# EAGLE design M191X (EAGLE 6.6.0)
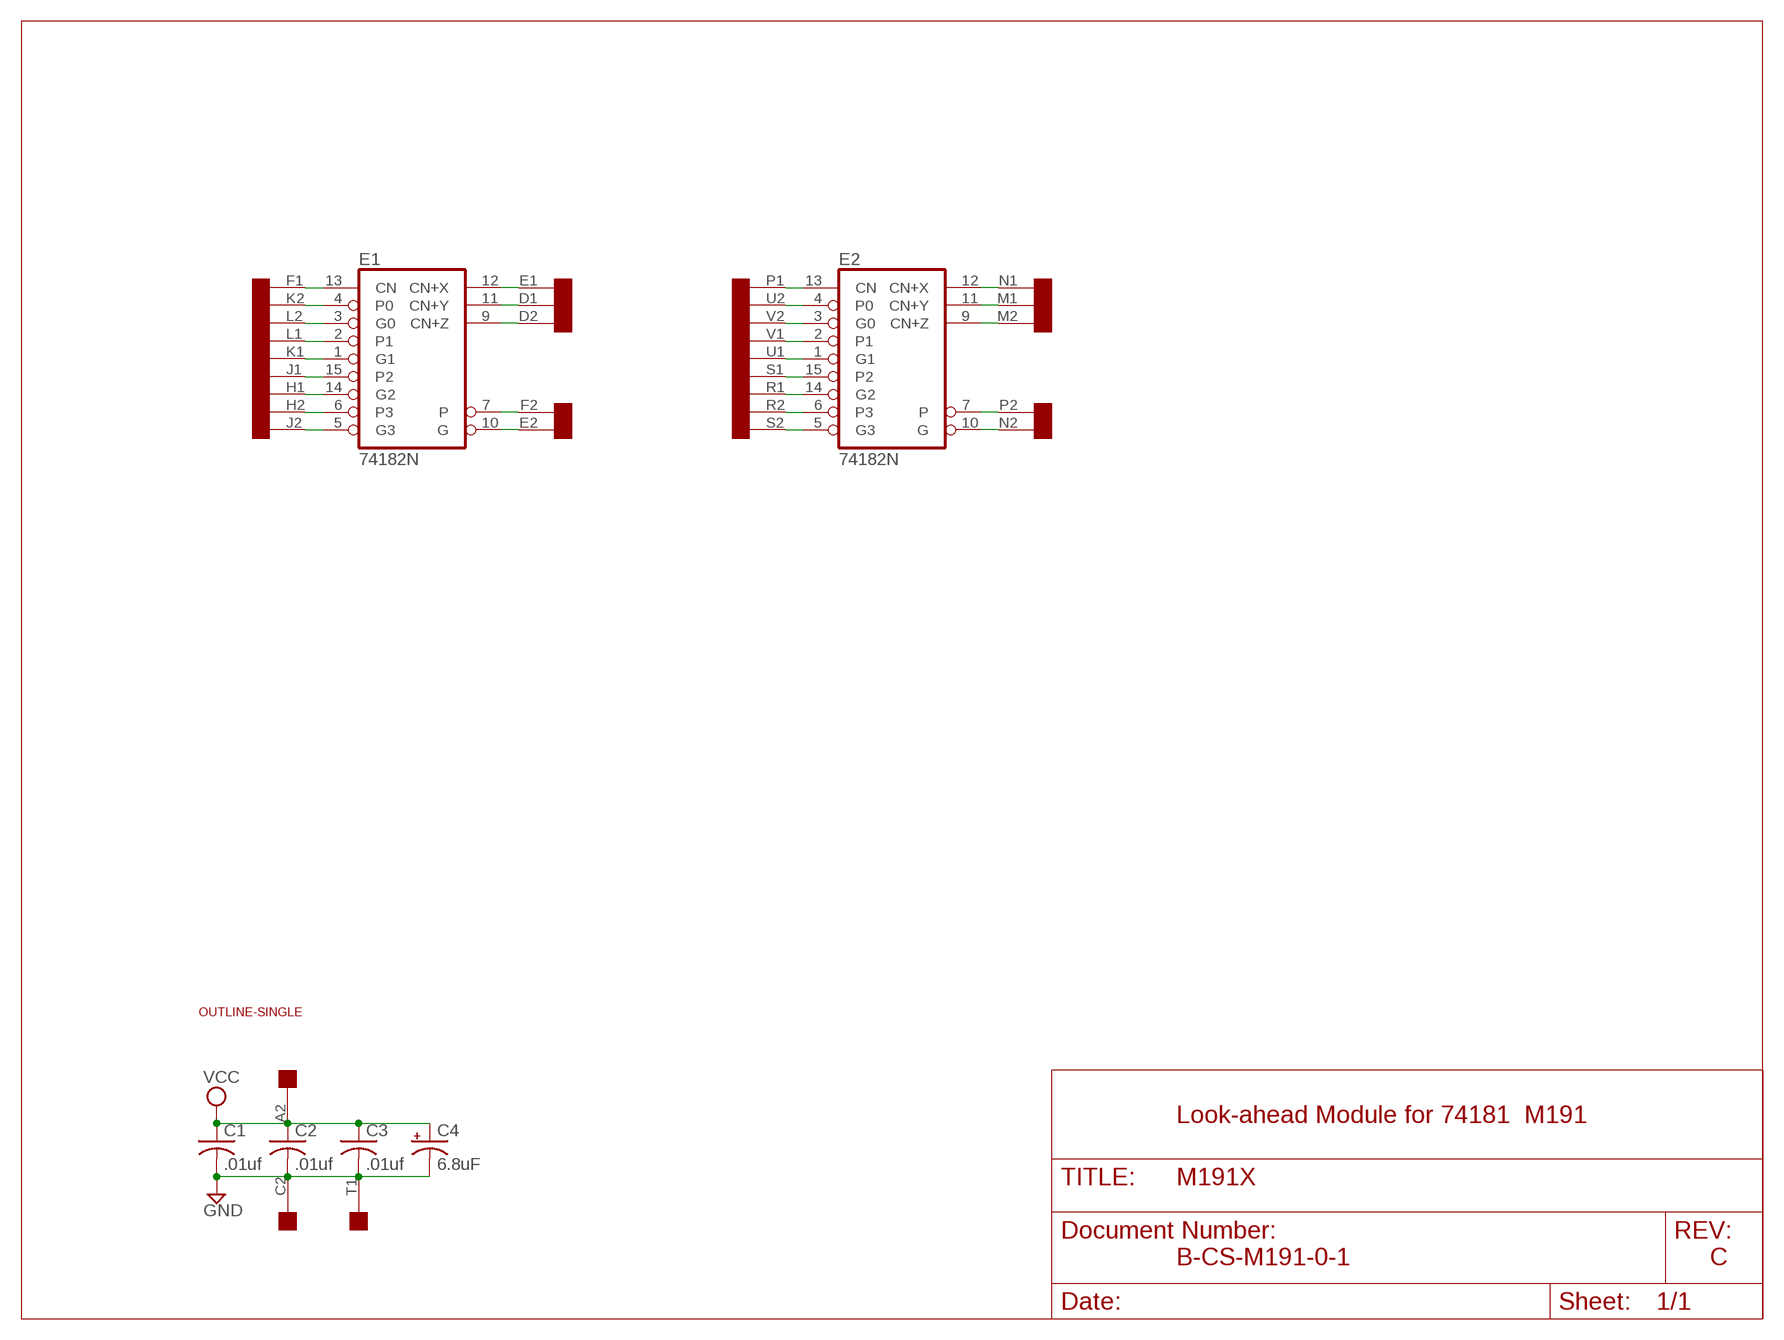
[diagram p0: schematic, sheet 1]

## Parts
C1  .01uf  C-US050-025X075  [C050-025X075]
C2  .01uf  C-US050-025X075  [C050-025X075]
C3  .01uf  C-US050-025X075  [C050-025X075]
C4  6.8uF  CPOL-USE22-6AXIAL  [E22-6]
E1  74182N  74S182N  [DIL16]
E2  74182N  74S182N  [DIL16]
U$1  OUTLINE-SINGLE  [SINGLE]
U$2  EDGE-2CONNECTOR  [EDGE-CON2]

## Nets
GND [Supply]: C1.2 C2.2 C3.2 C4.- U$2.C2 U$2.T1
N$1: E1.6(P3) U$2.H2
N$2: E1.2(P1) U$2.L1
N$3: E1.5(G3) U$2.J2
N$4: E1.15(P2) U$2.J1
N$5: E1.14(G2) U$2.H1
N$6: E1.1(G1) U$2.K1
N$7: E1.4(P0) U$2.K2
N$8: E1.3(G0) U$2.L2
N$9: E1.13(CN) U$2.F1
N$10: E1.7(P) U$2.F2
N$11: E1.10(G) U$2.E2
N$12: E1.9(CN+Z) U$2.D2
N$13: E1.11(CN+Y) U$2.D1
N$14: E1.12(CN+X) U$2.E1
N$15: E2.13(CN) U$2.P1
N$16: E2.3(G0) U$2.V2
N$17: E2.4(P0) U$2.U2
N$18: E2.1(G1) U$2.U1
N$19: E2.2(P1) U$2.V1
N$20: E2.15(P2) U$2.S1
N$21: E2.14(G2) U$2.R1
N$22: E2.6(P3) U$2.R2
N$23: E2.5(G3) U$2.S2
N$24: E2.7(P) U$2.P2
N$25: E2.10(G) U$2.N2
N$26: E2.9(CN+Z) U$2.M2
N$27: E2.11(CN+Y) U$2.M1
N$28: E2.12(CN+X) U$2.N1
VCC [Supply]: C1.1 C2.1 C3.1 C4.+ U$2.A2
Unconnected: U$2.A1 U$2.B1 U$2.B2 U$2.C1 U$2.T2

## Notes on the sheet
- Look-ahead Module for 74181  M191
- B-CS-M191-0-1 | C

## Power pins joined to a net without a drawn wire
GND: E1.8(GND) E2.8(GND)
VCC: E1.16(VCC) E2.16(VCC)

## Library data of the parts
C1-C3 = rcl:C-US: CAPACITOR, American symbol
C4 = rcl:CPOL-US: POLARIZED CAPACITOR, American symbol
E1 E2 = 74xx-us:74*182: LOOK AHEAD CARRY GENERATOR
U$1 = dec-con:OUTLINE-*: Board outlines for DEC boards.
U$2 = dec-con:EDGE-2: Double-Sided DEC edge connector.

## Net classes
1 Supply: width 0.813 mm

## Board
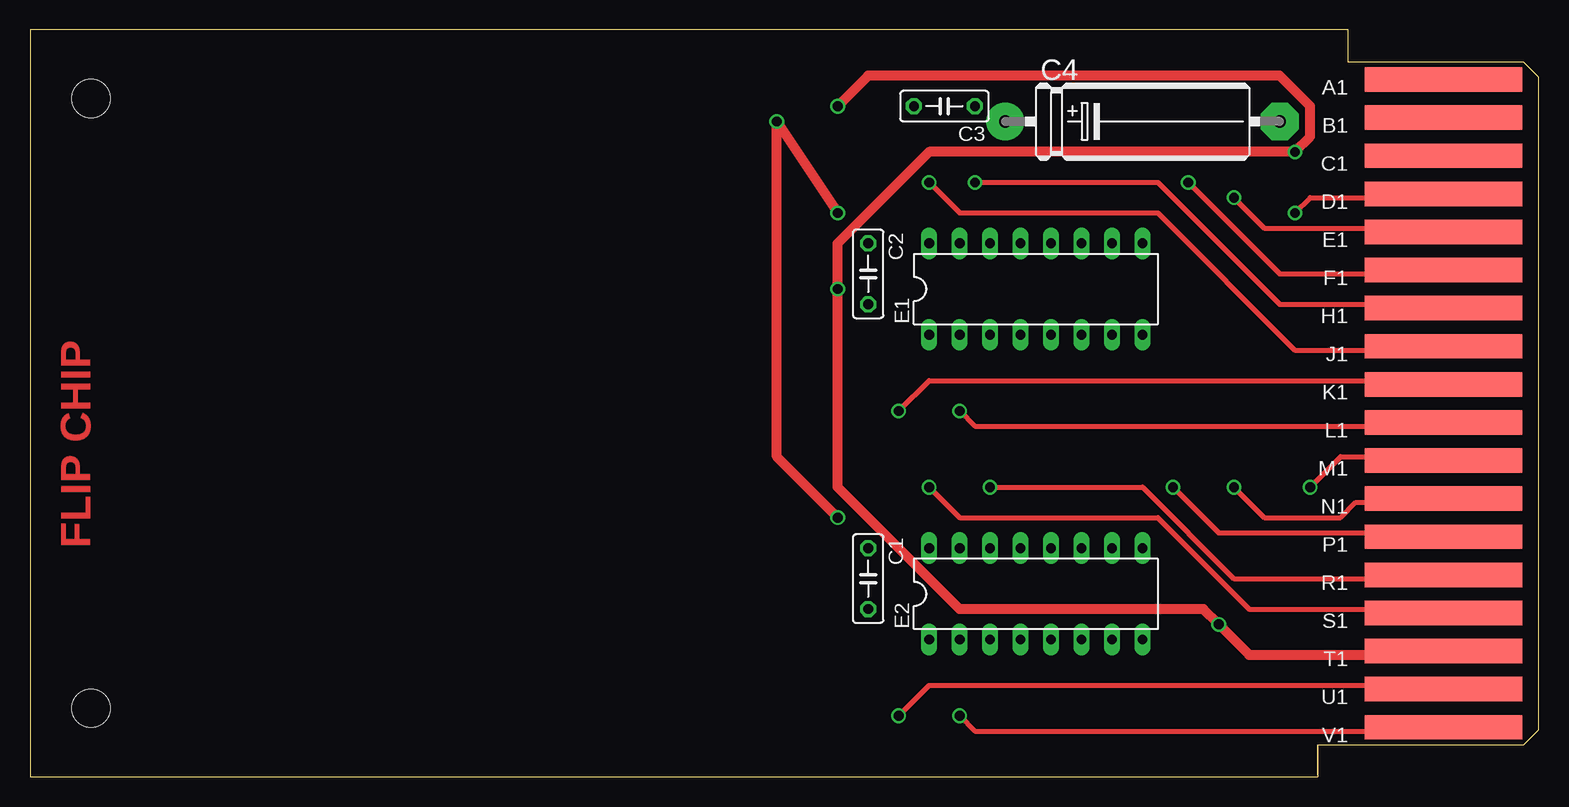
[diagram p1: board, top side]
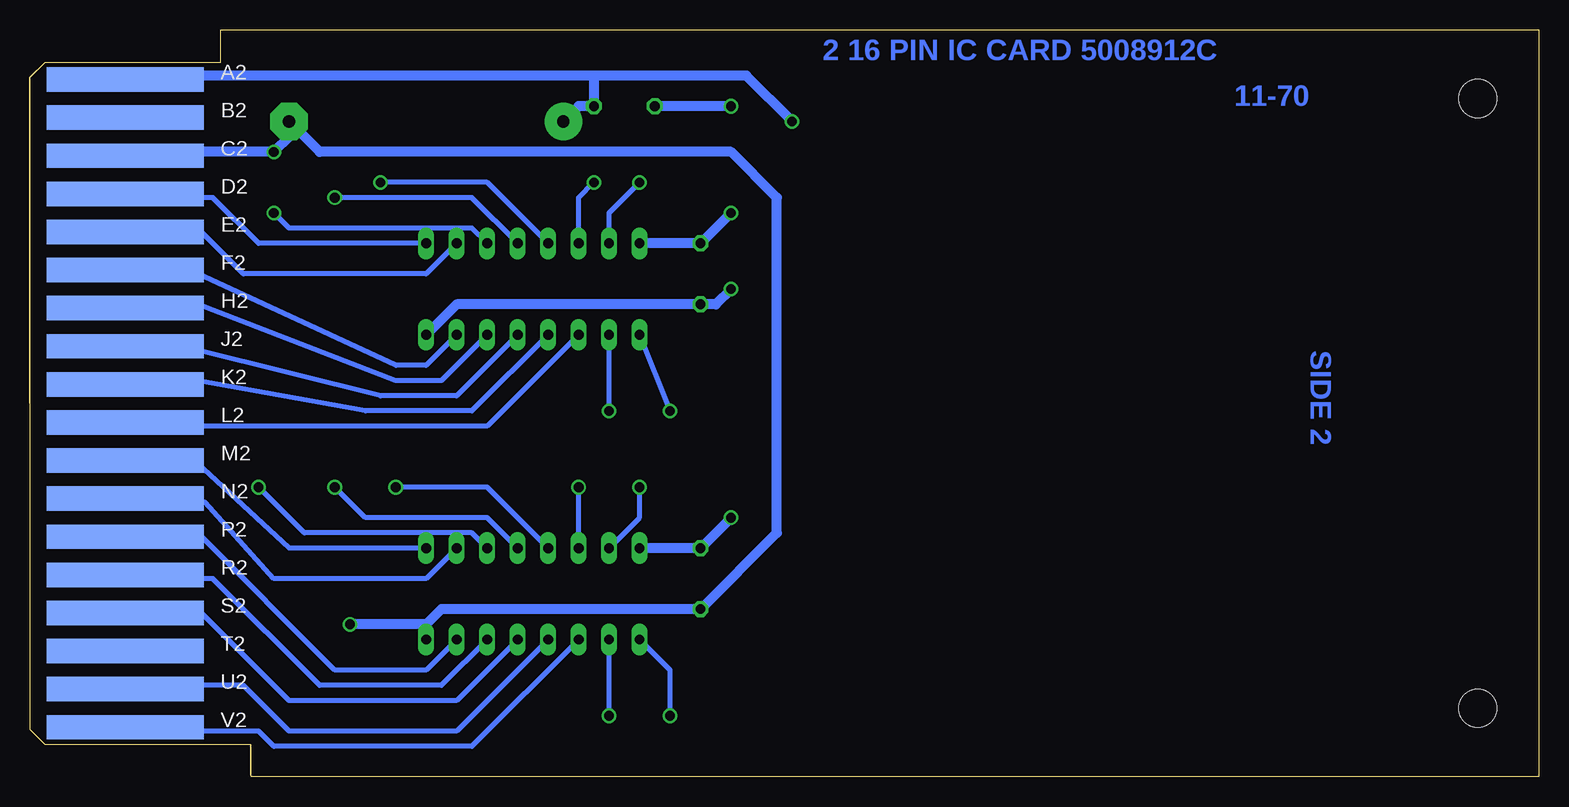
[diagram p2: board, bottom side, seen from below]

Size 125.73 x 62.23 mm. Coordinates in mm from the lower left corner, seen from the top.
Copper layers (1+16): Top 0.035mm / dielectric 1.5mm / Bottom 0.035mm
Design rules "16mils": minimum track width 16mil, minimum drill 32mil, track to track 15mil, track to pad 10mil, pad to pad 10mil, via to via 10mil, smd to smd 10mil, copper to edge 13mil, drill to drill 10mil, minimum pad ring 10mil, minimum via ring 8mil, stop-mask expansion 0mil, vias tented up to drill 0mil, thermal gap 10mil

### Footprints (pad centres in the part's own frame; a part is rotated, then mirrored left to right if it is on the bottom)
C050-025X075 = drill 0.813 octagon: 1 -2.54,0; 2 2.54,0
E22-6 = drill 1.016 pad 3.15: + -11.43,0 | drill 1.016 pad 3.15 octagon: - 11.43,0
DIL16 = drill 0.813 long: 1 -8.89,-3.81; 2 -6.35,-3.81; 3 -3.81,-3.81; 4 -1.27,-3.81; 5 1.27,-3.81; 6 3.81,-3.81; 7 6.35,-3.81; 8 8.89,-3.81; 9 8.89,3.81; 10 6.35,3.81; 11 3.81,3.81; 12 1.27,3.81; 13 -1.27,3.81; 14 -3.81,3.81; 15 -6.35,3.81; 16 -8.89,3.81
SINGLE = hole 3.175: 120.65,56.515; 120.65,5.715
EDGE-CON2 = smd 13.106 x 2.032: A1 7.938,4.128; B1 7.938,7.303; C1 7.938,10.477; D1 7.938,13.652; E1 7.938,16.828; F1 7.938,20.003; H1 7.938,23.177; J1 7.938,26.352; K1 7.938,29.527; L1 7.938,32.703; M1 7.938,35.877; N1 7.938,39.053; P1 7.938,42.227; R1 7.938,45.403; S1 7.938,48.578; T1 7.938,51.752; U1 7.938,54.928; V1 7.938,58.102 | smd 13.106 x 2.032 bottom: A2 7.938,4.128; B2 7.938,7.303; C2 7.938,10.477; D2 7.938,13.652; E2 7.938,16.828; F2 7.938,20.003; H2 7.938,23.177; J2 7.938,26.352; K2 7.938,29.527; L2 7.938,32.703; M2 7.938,35.877; N2 7.938,39.053; P2 7.938,42.227; R2 7.938,45.403; S2 7.938,48.578; T2 7.938,51.752; U2 7.938,54.928; V2 7.938,58.102

### Placement (x,y rotation side)
C1  69.85,16.51 270 top
C2  69.85,41.91 270 top
C3  76.2,55.88 180 top
C4  92.71,54.61 0 top
E1  83.82,40.64 0 top
E2  83.82,15.24 0 top
U$1  125.73,62.23 180 top
U$2  125.73,62.23 180 top
U$3  [FLIPCHIP]  0,0 0 top

### Tracks (layer width: path | path; a pad name or v marks a point on that pad's centre or on a via)
GND  (via drill 0.81)
  Top 0.813: U$2.T1 117.17,10.49 116.84,10.16 101.6,10.16 v99.06,12.7 97.79,13.97 77.47,13.97 67.31,24.13 v67.31,40.64 67.31,44.45 74.93,52.07 v105.41,52.07 106.68,53.34 106.68,55.88 104.14,58.42 69.85,58.42 v67.31,55.88
  Bottom 0.813: 92.71,12.7 v99.06,12.7 | 92.71,12.7 E2.8 | 92.71,12.7 91.44,13.97 C1.2 63.5,20.32 63.5,48.26 67.31,52.07 101.6,52.07 C4.- 104.14,53.34 v105.41,52.07 116.84,52.07 117.17,51.74 U$2.C2 | v67.31,55.88 C3.2 | v67.31,40.64 68.58,39.37 C2.2 90.17,39.37 E1.8
N$1
  Bottom 0.406: U$2.H2 115.9,39.04 115.57,39.37 111.76,39.37 95.25,33.02 91.44,33.02 E1.6
N$2  (via drill 0.81)
  Top 0.406: U$2.L1 117.17,29.54 116.84,29.21 78.74,29.21 v77.47,30.48
  Bottom 0.406: v77.47,30.48 E1.2
N$3
  Bottom 0.406: U$2.J2 117.17,35.89 116.84,35.56 111.76,35.56 96.52,31.75 90.17,31.75 E1.5
N$4  (via drill 0.81)
  Top 0.406: U$2.J1 117.17,35.89 116.84,35.56 105.41,35.56 93.98,46.99 77.47,46.99 v74.93,49.53
  Bottom 0.406: E1.15 77.47,46.99 v74.93,49.53
N$5  (via drill 0.81)
  Top 0.406: U$2.H1 117.17,39.04 116.84,39.37 104.14,39.37 93.98,49.53 v78.74,49.53
  Bottom 0.406: E1.14 80.01,48.26 v78.74,49.53
N$6  (via drill 0.81)
  Top 0.406: U$2.K1 117.14,32.72 116.84,33.02 74.93,33.02 v72.39,30.48
  Bottom 0.406: v72.39,30.48 E1.1
N$7
  Bottom 0.406: U$2.K2 117.14,32.72 116.84,33.02 111.76,33.02 97.79,30.48 88.9,30.48 E1.4
N$8
  Bottom 0.406: U$2.L2 117.17,29.54 116.84,29.21 87.63,29.21 E1.3
N$9  (via drill 0.81)
  Top 0.406: U$2.F1 117.12,42.19 116.84,41.91 104.14,41.91 v96.52,49.53
  Bottom 0.406: v96.52,49.53 87.63,49.53 E1.13
N$10
  Bottom 0.406: U$2.F2 117.12,42.19 116.84,41.91 111.76,41.91 95.25,34.29 92.71,34.29 E1.7
N$11
  Bottom 0.406: U$2.E2 115.9,45.39 115.57,45.72 111.76,45.72 107.95,41.91 92.71,41.91 E1.10
N$12
  Bottom 0.406: U$2.D2 117.14,48.56 116.84,48.26 110.49,48.26 106.68,44.45 E1.9
N$13  (via drill 0.81)
  Top 0.406: U$2.D1 117.14,48.56 116.84,48.26 106.68,48.26 v105.41,46.99
  Bottom 0.406: v105.41,46.99 104.14,45.72 88.9,45.72 E1.11
N$14  (via drill 0.81)
  Top 0.406: U$2.E1 117.17,45.39 116.84,45.72 102.87,45.72 v100.33,48.26
  Bottom 0.406: v100.33,48.26 88.9,48.26 E1.12
N$15  (via drill 0.81)
  Top 0.406: U$2.P1 117.17,19.99 116.84,20.32 99.06,20.32 v95.25,24.13
  Bottom 0.406: v95.25,24.13 87.63,24.13 E2.13
N$16
  Bottom 0.406: U$2.V2 117.23,4.2 116.84,3.81 106.68,3.81 105.41,2.54 88.9,2.54 E2.3
N$17
  Bottom 0.406: U$2.U2 117.2,7.26 116.84,7.62 107.95,7.62 104.14,3.81 90.17,3.81 E2.4
N$18  (via drill 0.81)
  Top 0.406: U$2.U1 117.2,7.26 116.84,7.62 74.93,7.62 v72.39,5.08
  Bottom 0.406: v72.39,5.08 72.39,8.89 E2.1
N$19  (via drill 0.81)
  Top 0.406: U$2.V1 117.23,4.2 116.84,3.81 78.74,3.81 v77.47,5.08
  Bottom 0.406: v77.47,5.08 E2.2
N$20  (via drill 0.81)
  Top 0.406: U$2.S1 117.14,13.66 116.84,13.97 101.6,13.97 93.98,21.59 77.47,21.59 v74.93,24.13
  Bottom 0.406: v74.93,24.13 74.93,21.59 E2.15
N$21  (via drill 0.81)
  Top 0.406: U$2.R1 117.17,16.84 116.84,16.51 100.33,16.51 92.71,24.13 v80.01,24.13
  Bottom 0.406: E2.14 v80.01,24.13
N$22
  Bottom 0.406: U$2.R2 115.9,16.84 115.57,16.51 110.49,16.51 101.6,7.62 91.44,7.62 E2.6
N$23
  Bottom 0.406: U$2.S2 117.78,13.97 111.76,13.97 104.14,6.35 90.17,6.35 E2.5
N$24
  Bottom 0.406: U$2.P2 117.17,19.99 116.84,20.32 111.76,20.32 100.33,8.89 92.71,8.89 E2.7
N$25
  Bottom 0.406: U$2.N2 117.17,23.19 116.84,22.86 111.12,22.86 105.41,16.51 92.71,16.51 E2.10
N$26
  Bottom 0.406: U$2.M2 117.17,26.34 116.84,26.67 112.39,26.67 104.14,19.05 E2.9
N$27  (via drill 0.81)
  Top 0.406: U$2.M1 117.17,26.34 116.84,26.67 109.22,26.67 v106.68,24.13
  Bottom 0.406: v106.68,24.13 102.87,20.32 88.9,20.32 E2.11
N$28  (via drill 0.81)
  Top 0.406: U$2.N1 115.9,23.19 115.57,22.86 110.49,22.86 109.22,21.59 102.87,21.59 v100.33,24.13
  Bottom 0.406: v100.33,24.13 97.79,21.59 87.63,21.59 E2.12
VCC  (via drill 0.81)
  Top 0.813: v67.31,46.99 v62.23,54.61 62.23,26.67 v67.31,21.59
  Bottom 0.813: C1.1 E2.16 C1.1 | C1.1 v67.31,21.59 | U$2.A2 117.24,58.02 116.84,58.42 78.74,58.42 | 78.74,58.42 C3.1 80.01,55.88 C4.+ | 78.74,58.42 66.04,58.42 v62.23,54.61 | E1.16 C2.1 v67.31,46.99

### Text on the board
Bottom: 2 16 PIN IC CARD 5008912C | 11-70 | SIDE 2